# Altium schematic sheet EMMC.schdoc: =
size A4; Symbol: Sheet-Symbol_A4; Company: 嘉立创EDA; Version: V1.0; Page Size: A4; @Project Name: RK3568B2地瓜派; @Page Count: 27; @Update Date: 2025-09-11; @Create Date: 2025-09-11; @Schematic Name: Schematic1; @Page No: 17; @Page Name: EMMC; Device: Sheet-Symbol_A4; Border: 1; Title Block Position: 3; Width: 1170; Height: 825; Region Start: 1; X Region Count: 6; Y Region Count: 4; Blade Width: 10; @Board Name: Board1; @Create Time: 22:14:46; @Update Time: 22:15:06; Organization: ORGANIZATION; Address1: ADDRESS 1; Address2: ADDRESS 2; Address3: ADDRESS 3; Address4: ADDRESS 4; SheetNumber: 23; SheetTotal: 28
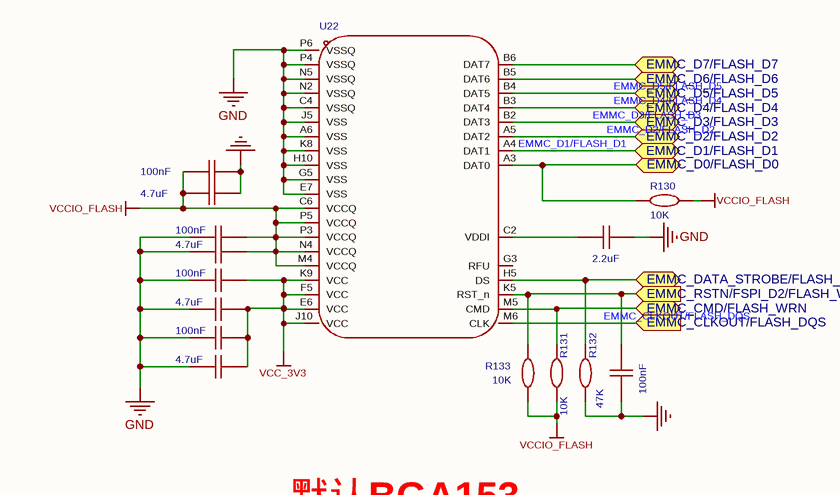
[diagram p0: EMMC.schdoc]

## Parts
C251  100nF  [c0402-nsk]
C252  4.7uF  [c0402-nsk]
C253  100nF  [c0402-nsk]
C254  4.7uF  [c0402-nsk]
C255  value 2.2uF  [c0402-nsk]  (hidden comment: CL10A225KO8NNNC)
C256  100nF  [c0402-nsk]
C257  4.7uF  [c0402-nsk]
C258  100nF  [c0402-nsk]
C259  4.7uF  [c0402-nsk]
C260  value 100nF  [c0402-nsk]  (hidden comment: CL10A475KO8NNNC)
R130  10K  [R0402]
R131  10K  [R0402]
R132  47K  [R0402]
R133  10K  [R0402]
U22  (no value)  [fbga-153_l13.0-w11.5-p0.50_klmag1jetd-b041]

## Ports
EMMC_CLKOUT/FLASH_DQS (in), EMMC_CMD/FLASH_WRN (bidir), EMMC_D0/FLASH_D0 (bidir), EMMC_D1/FLASH_D1 (bidir), EMMC_D2/FLASH_D2 (bidir), EMMC_D3/FLASH_D3 (bidir), EMMC_D4/FLASH_D4 (bidir), EMMC_D5/FLASH_D5 (bidir), EMMC_D6/FLASH_D6 (bidir), EMMC_D7/FLASH_D7 (bidir), EMMC_DATA_STROBE/FLASH_CLE (bidir), EMMC_RSTN/FSPI_D2/FLASH_WPN (in)

## Nets
GND: C251.2 C252.2 C253.1 C254.1 C255.1 C256.1 C257.1 C258.1 C259.1 C260.1 R132.1 U22.A6(VSS) U22.C4(VSSQ) U22.E7(VSS) U22.G5(VSS) U22.H10(VSS) U22.J5(VSS) U22.K8(VSS) U22.N2(VSSQ) U22.N5(VSSQ) U22.P4(VSSQ) U22.P6(VSSQ)
VCC_3V3: C256.2 C257.2 C258.2 C259.2 U22.E6(VCC) U22.F5(VCC) U22.J10(VCC) U22.K9(VCC)
VCCIO_FLASH: C251.1 C252.1 C253.2 C254.2 R130.2 R131.1 R133.1 U22.C6(VCCQ) U22.M4(VCCQ) U22.N4(VCCQ) U22.P3(VCCQ) U22.P5(VCCQ)
EMMC_CLKOUT/FLASH_DQS: U22.M6(CLK) ; port EMMC_CLKOUT/FLASH_DQS
EMMC_CMD/FLASH_WRN: R131.2 U22.M5(CMD) ; port EMMC_CMD/FLASH_WRN
EMMC_D0/FLASH_D0: R130.1 U22.A3(DAT0) ; port EMMC_D0/FLASH_D0
EMMC_D1/FLASH_D1: U22.A4(DAT1) ; port EMMC_D1/FLASH_D1
EMMC_D2/FLASH_D2: U22.A5(DAT2) ; port EMMC_D2/FLASH_D2
EMMC_D3/FLASH_D3: U22.B2(DAT3) ; port EMMC_D3/FLASH_D3
EMMC_D4/FLASH_D4: U22.B3(DAT4) ; port EMMC_D4/FLASH_D4
EMMC_D5/FLASH_D5: U22.B4(DAT5) ; port EMMC_D5/FLASH_D5
EMMC_D6/FLASH_D6: U22.B5(DAT6) ; port EMMC_D6/FLASH_D6
EMMC_D7/FLASH_D7: U22.B6(DAT7) ; port EMMC_D7/FLASH_D7
EMMC_DATA_STROBE/FLASH_CLE: R132.2 U22.H5(DS) ; port EMMC_DATA_STROBE/FLASH_CLE
EMMC_RSTN/FSPI_D2/FLASH_WPN: C260.2 R133.2 U22.K5(RST_n) ; port EMMC_RSTN/FSPI_D2/FLASH_WPN
NetC255_2: C255.2 U22.C2(VDDI)

Not connected (* = marked no-connect by the designer): U22 G3(RFU)

## Notes on the sheet
- 默认BGA153
- Drawn By :
- Checked By :
- Approved By :
- SheetNumber
- SheetTotal
- Revision :
- Time :
- Size :
- Date :
- A4
- DocumentName :
- Project :

## Library data of the parts
C251 C253 C256 C258 = CC0603KRX7R9BB104: 容值:100nF;精度:±10%;额定电压:50V;材质(温度系数):X7R;; Manufacturer: YAGEO(国巨); Symbol: CapAcitance; AddInBom: yes; ModelId: ac125912035d415993ca9572d50418b1; ModelName: C0603_L1.6-W0.8-H0.8; ModelTransform: 62.992,31.496,0,0,0,0,0,0,0; Tolerance: ±10%; Voltage Rated: 50V; Temperature Coefficient: X7R; Value: 100nF; Device: CC0603KRX7R9BB104; LCSC Part Name: 100nF ±10% 50V; SupplierPart: C14663; ManufacturerPart: CC0603KRX7R9BB104; Supplier Footprint: 0603; JLCPCB Part Class: Basic Part; Datasheet: https://atta.szlcsc.com/upload/public/pdf/source/20180910/C282072_33301C7F631E79921B82A8DAC6BCC5B3.pdf; Supplier: LCSC; ConvertToPcb: yes; FootprintName: c0402-nsk
C252 C254 C257 C259 C260 = CL10A475KO8NNNC: 容值:4.7uF;精度:±10%;额定电压:16V;材质(温度系数):X5R;; Manufacturer: SAMSUNG(三星); Symbol: CapAcitance; AddInBom: yes; ModelId: ac125912035d415993ca9572d50418b1; ModelName: C0603_L1.6-W0.8-H0.8; ModelTransform: 62.992,31.496,0,0,0,0,0,0,0; Tolerance: ±10%; Voltage Rated: 16V; Temperature Coefficient: X5R; Device: CL10A475KO8NNNC; LCSC Part Name: 4.7uF ±10% 16V; ManufacturerPart: CL10A475KO8NNNC; Supplier Footprint: 0603; JLCPCB Part Class: Basic Part; Datasheet: https://atta.szlcsc.com/upload/public/pdf/source/20160103/1457707703134.pdf; Supplier: LCSC; ConvertToPcb: yes; FootprintName: c0402-nsk
  C252 C254 C257 C259: Value: 4.7uF; SupplierPart: C19666
C255 = CL10A225KO8NNNC: 容值:2.2uF;精度:±10%;额定电压:16V;材质(温度系数):X5R;; Manufacturer: SAMSUNG(三星); Symbol: CapAcitance; AddInBom: yes; ModelId: ac125912035d415993ca9572d50418b1; ModelName: C0603_L1.6-W0.8-H0.8; ModelTransform: 62.992,31.496,0,0,0,0,0,0,0; Tolerance: ±10%; Voltage Rated: 16V; Temperature Coefficient: X5R; Device: CL10A225KO8NNNC; Supplier Part: C23630; LCSC Part Name: 2.2uF ±10% 16V; ManufacturerPart: CL10A225KO8NNNC; Supplier Footprint: 0603; JLCPCB Part Class: Basic Part; Datasheet: https://atta.szlcsc.com/upload/public/pdf/source/20160103/1457707709512.pdf; Supplier: LCSC; ConvertToPcb: yes; FootprintName: c0402-nsk
R130-R133 = Res_0402: Symbol: 电阻; ConvertToPcb: yes; ModelId: 671aefced39d4c318694bba8bd8efd39; ModelName: R0402_L1.0-W0.5-H0.5; ModelTransform: 39.37,19.685,0,0,0,0,0,0.0005,0; Device: Res_0402; AddInBom: yes; Supplier Footprint: 0402; FootprintName: R0402
  R130 R131 R133: Value: 10K
  R132: Value: 47K
U22 = EMMC BGA153: Manufacturer: Kingston(金士顿); ManufacturerPart: EMMC04G-M627-A01; Pin Type: IN; AddInBom: yes; Device: EMMC BGA153; Symbol: EMMC BGA153; Supplier: LCSC; SupplierPart: C577446; ConvertToPcb: yes; FootprintName: fbga-153_l13.0-w11.5-p0.50_klmag1jetd-b041